# EAGLE design Arduino-WiFi-Shield v1.1 (EAGLE 5.11)
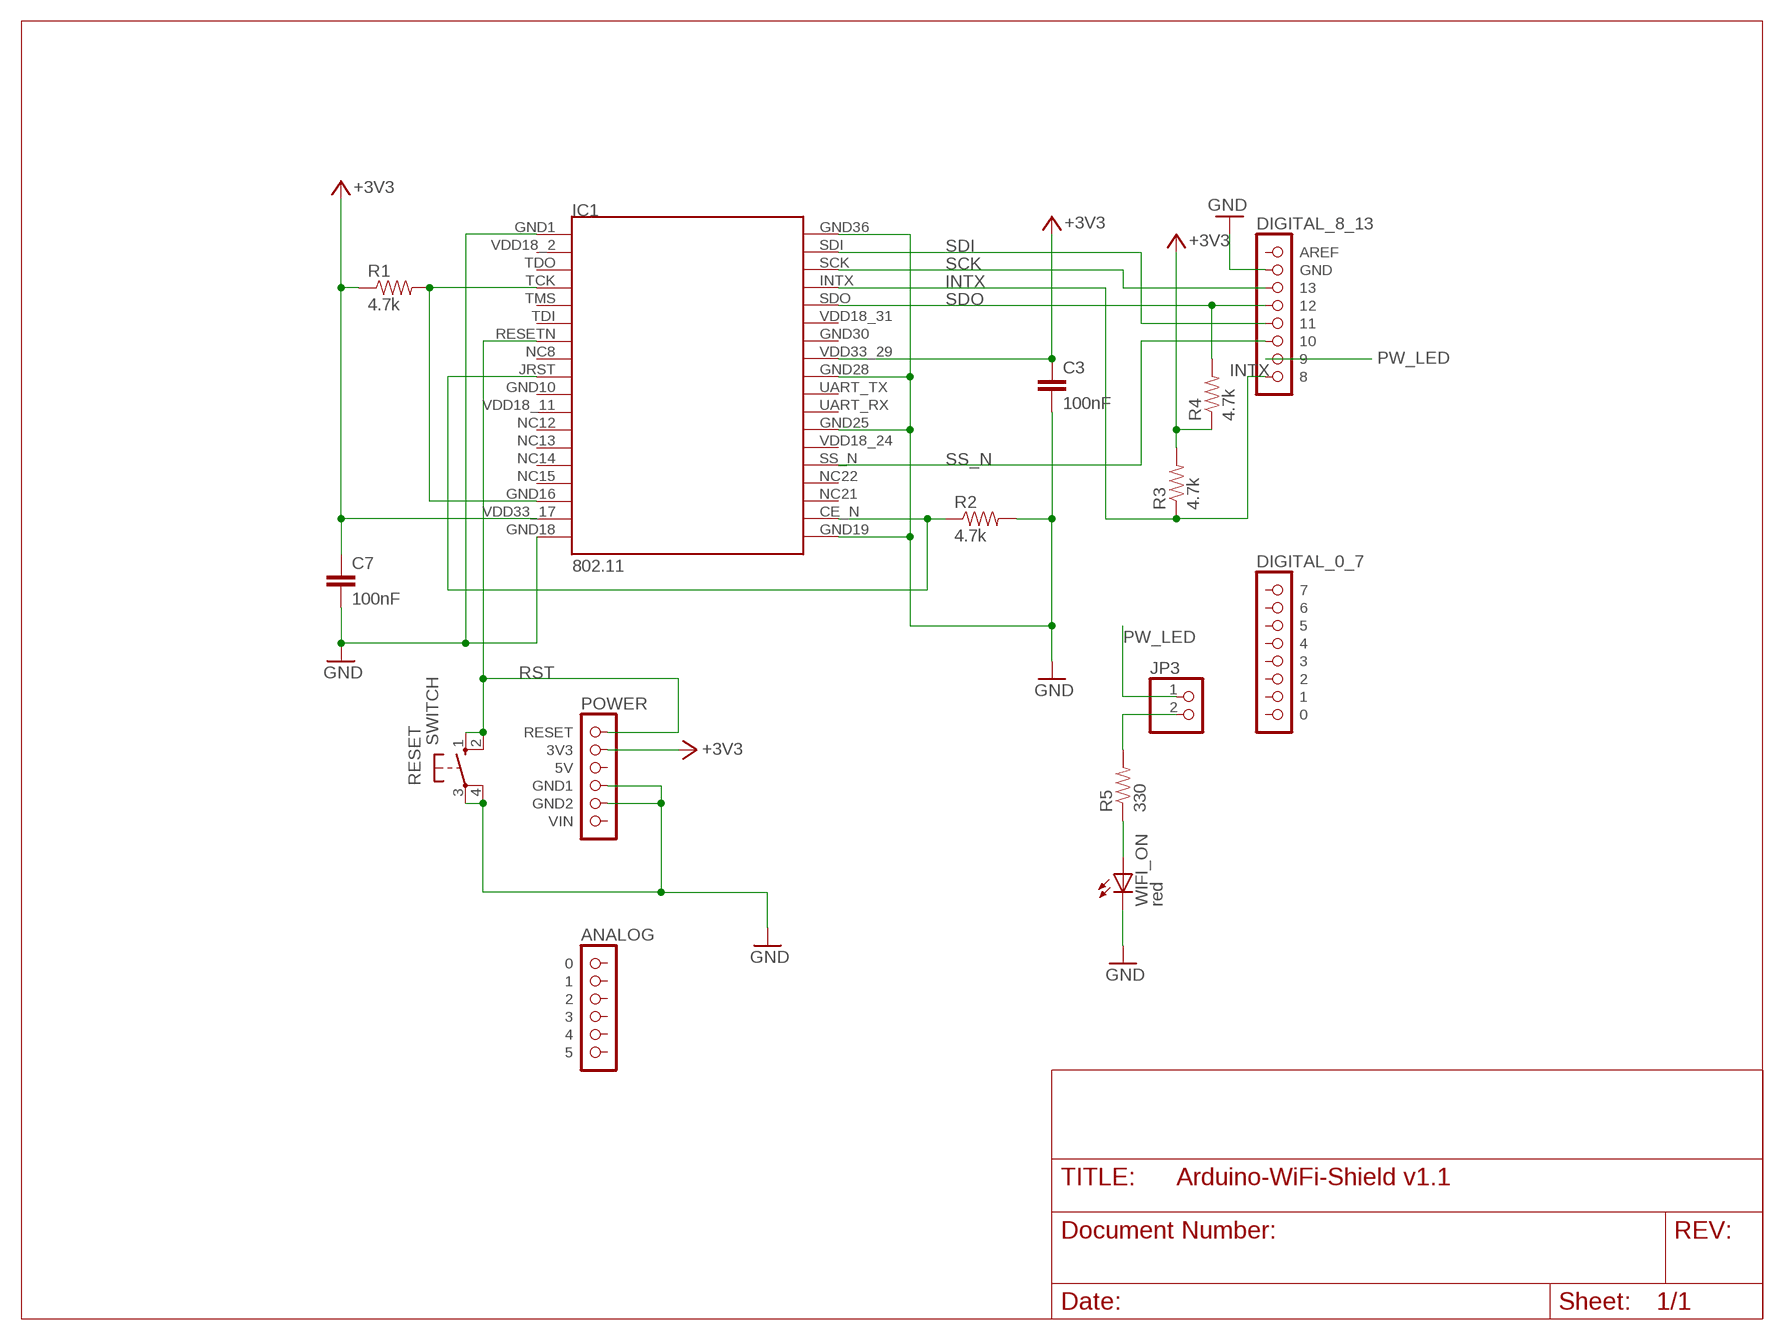
[diagram p0: schematic, sheet 1]

## Parts
C3  100nF  CAPACITOR0603-CAP  [0603-CAP]
C7  100nF  CAPACITOR0603-CAP  [0603-CAP]
IC1  802.11  ZG2100MOD  [ZG2100MOD]
JP3  PINHD2  [PINHD2]
R1  4.7k  RESISTOR0603-RES  [0603-RES]
R2  4.7k  RESISTOR0603-RES  [0603-RES]
R3  4.7k  RESISTOR0603-RES  [0603-RES]
R4  4.7k  RESISTOR0603-RES  [0603-RES]
R5  330  RESISTOR0603-RES  [0603-RES]
RESET  SWITCH  [SWITCH]
U$1  POWER  [1X06]
U$2  ANALOG  [1X06]
U$3  DIGITAL_0_7  [1X08]
U$4  DIGITAL_8_13  [1X08]
WIFI_ON  red  LED0603  [LED-0603]

## Nets
+3V3: C3.1 C7.1 IC1.VDD33_17 IC1.VDD33_29 R1.1 R3.2 R4.1 U$1.2(3V3)
CE_N: IC1.CE_N IC1.JRST R2.1
GND: C3.2 C7.2 IC1.GND1 IC1.GND18 IC1.GND19 IC1.GND25 IC1.GND28 IC1.GND36 R2.2 RESET.3(P) RESET.4(P1) U$1.4(GND1) U$1.5(GND2) U$4.2(GND) WIFI_ON.C
INTX: IC1.INTX R3.1 U$4.8
N$1: JP3.2 R5.2
N$2: R5.1 WIFI_ON.A
PW_LED: JP3.1 U$4.7
RST: IC1.RESETN(RSTN) RESET.1(S) RESET.2(S1) U$1.1(RESET)
SCK: IC1.SCK U$4.3
SDI: IC1.SDI U$4.5
SDO: IC1.SDO R4.2 U$4.4
SS_N: IC1.SS_N U$4.6
VDD_TIE: IC1.GND16 IC1.TCK R1.2
Unconnected: IC1.NC8 IC1.NC12 IC1.NC13 IC1.NC14 IC1.NC15 IC1.NC21 IC1.NC22 IC1.TDI IC1.TDO IC1.TMS IC1.UART_RX IC1.UART_TX IC1.VDD18_2 IC1.VDD18_11 IC1.VDD18_24 IC1.VDD18_31 U$1.3(5V) U$1.6(VIN) U$2.1 U$2.2 U$2.3 U$2.4 U$2.5 U$2.6 U$3.1 U$3.2 U$3.3 U$3.4 U$3.5 U$3.6 U$3.7 U$3.8 U$4.1(AREF)

## Power pins joined to a net without a drawn wire
GND10: IC1.GND10
GND30: IC1.GND30

## Library data of the parts
C3 C7 = asynlabs:CAPACITOR: Capacitor Standard 0603 ceramic capacitor, and 0.1" leaded capacitor.
IC1 = ZGLIB:ZG2100MOD: ZG2100 Module
JP3 = ZGLIB:PINHD2
R1-R5 = asynlabs:RESISTOR: Resistor Basic schematic elements and footprints for 0603, 1206, and PTH 1/10th watt (small) resistors.
RESET = asynlabs:SWITCH
U$1 = arduino:POWER
U$2 = arduino:ANALOG
U$3 = arduino:DIGITAL_0_7
U$4 = arduino:DIGITAL_8_13
WIFI_ON = asynlabs:LED: LEDs Standard schematic elements and footprints for 5mm, 3mm, 1206, and 0603 sized LEDs. 5mm - Spark Fun Electronics SKU : COM-00529 (and others)

## Board
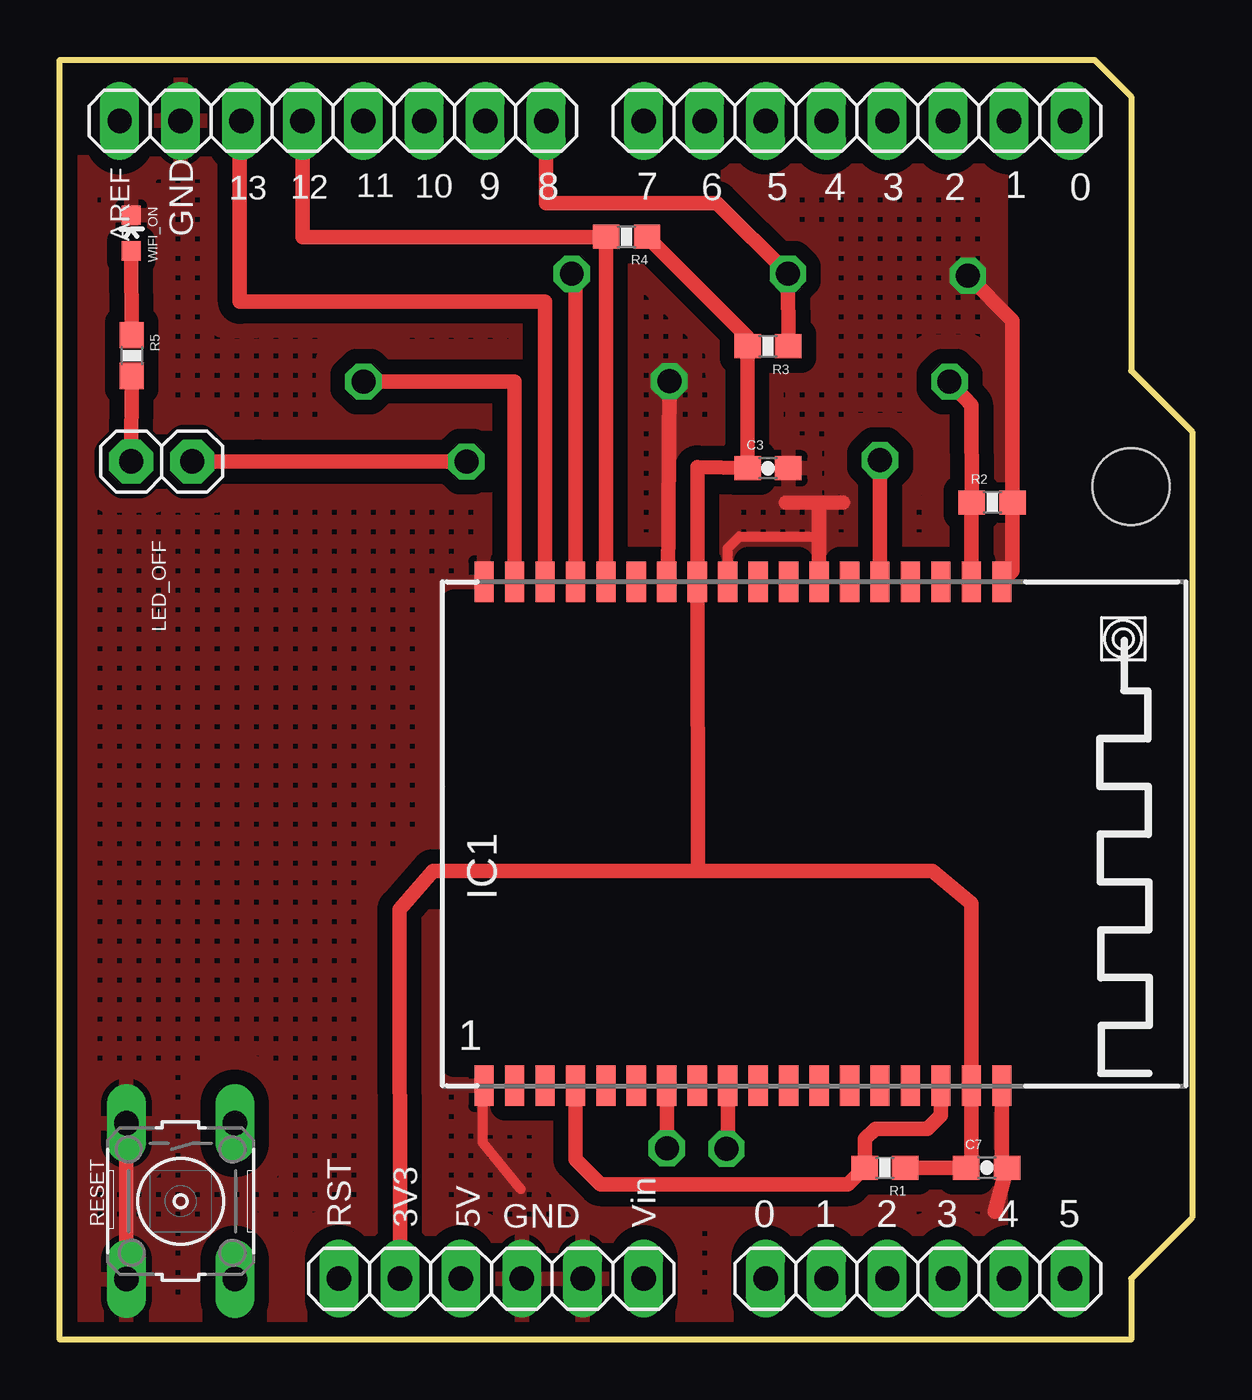
[diagram p1: board, top side]
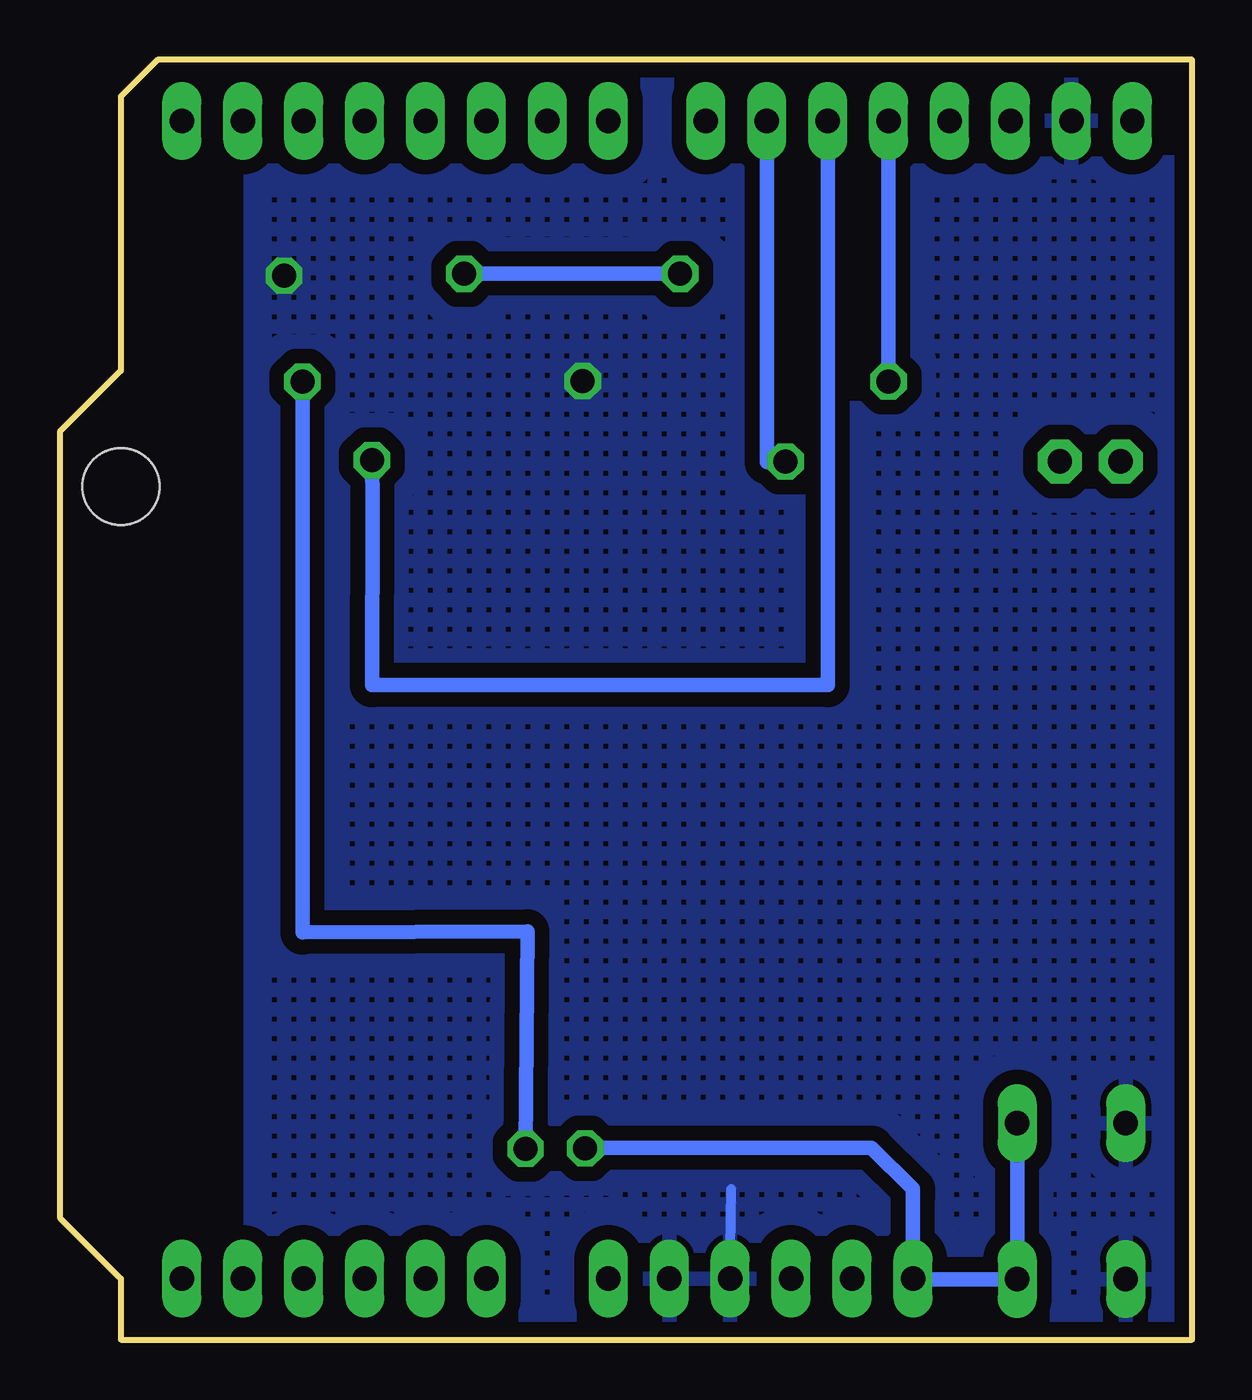
[diagram p2: board, bottom side, seen from below]

Size 47.19 x 53.34 mm. Coordinates in mm from the lower left corner, seen from the top.
Outline: 0,53.34 43.13,53.34 44.65,51.82 44.65,40.39 47.19,37.85 47.19,5.08 44.65,2.54 44.65,0 0,0 0,53.34
Copper layers (1*16): Top 0.035mm / dielectric 1.5mm / Bottom 0.035mm
Design rules "SparkFun *": minimum track width 8mil, minimum drill 16mil, track to track 8mil, track to pad 8mil, pad to pad 8mil, via to via 8mil, smd to smd 8mil, copper to edge 10mil, drill to drill 8mil, minimum pad ring 12mil, minimum via ring 10mil, stop-mask expansion 4mil, vias tented up to drill 25mil, thermal gap 10mil
Holes 3.2 mm at 44.65,35.56
tKeepout: area 39.9,30.7 to 46.8,31.7; area 39.8,10.4 to 46.8,11.5
tRestrict: area 16.5,11.6 to 47.2,30.7

### Footprints (pad centres in the part's own frame; a part is rotated, then mirrored left to right if it is on the bottom)
0603-CAP = smd 1.1 x 1: 1 -0.85,0; 2 0.85,0
ZG2100MOD = smd 0.8 x 1.7: CE_N 6.63,10.12; GND1 -13.69,-10.88; GND10 -2.26,-10.88; GND16 5.36,-10.88; GND18 7.9,-10.88; GND19 7.9,10.12; GND25 0.28,10.12; GND28 -3.53,10.12; GND30 -6.07,10.12; GND36 -13.69,10.12; INTX -9.88,10.12; JRST -3.53,-10.88; NC8 -4.8,-10.88; NC12 0.28,-10.88; NC13 1.55,-10.88; NC14 2.82,-10.88; NC15 4.09,-10.88; NC21 5.36,10.12; NC22 4.09,10.12; RESETN -6.07,-10.88; SCK -11.15,10.12; SDI -12.42,10.12; SDO -8.61,10.12; SS_N 2.82,10.12; TCK -9.88,-10.88; TDI -7.34,-10.88; TDO -11.15,-10.88; TMS -8.61,-10.88; UART_RX -0.99,10.12; UART_TX -2.26,10.12; VDD18_2 -12.42,-10.88; VDD18_11 -0.99,-10.88; VDD18_24 1.55,10.12; VDD18_31 -7.34,10.12; VDD33_17 6.63,-10.88; VDD33_29 -4.8,10.12
PINHD2 = drill 1.016 pad 1.829 octagon: 1 -1.27,0; 2 1.27,0
0603-RES = smd 1.1 x 1: 1 -0.85,0; 2 0.85,0
SWITCH = drill 1.016 long: 1 -3.251,2.261; 2 3.251,2.261; 3 -3.251,-2.261; 4 3.251,-2.261
1X06 = drill 1.016 long: 1 -6.35,0; 2 -3.81,0; 3 -1.27,0; 4 1.27,0; 5 3.81,0; 6 6.35,0
1X08 = drill 1.016 long: 1 -8.89,0; 2 -6.35,0; 3 -3.81,0; 4 -1.27,0; 5 1.27,0; 6 3.81,0; 7 6.35,0; 8 8.89,0
LED-0603 = smd 0.8 x 0.8: A 0,-0.75; C 0,0.75

### Placement (x,y rotation side)
C3  29.51,36.32 0 top
C7  38.63,7.16 0 top
IC1  31.37,21.46 0 top
JP3  4.24,36.6 180 top
R1  34.39,7.16 180 top
R2  38.86,34.9 0 top
R3  29.51,41.4 180 top
R4  23.62,45.97 180 top
R5  3,41.02 270 top
RESET  5.03,5.77 270 top
U$1  17.98,2.54 0 top
U$2  35.76,2.54 0 top
U$3  33.22,50.8 0 top
U$4  11.38,50.8 0 top
WIFI_ON  2.97,46.13 0 top

### Tracks (layer width: path | path; a pad name or v marks a point on that pad's centre or on a via)
+3V3
  Top 0.61: IC1.VDD33_29 26.59,31.56 | 26.59,19.53 27.61,19.53 36.37,19.53 38,18.19 IC1.VDD33_17 38,7.5 C7.1 R1.1 | 26.59,19.53 IC1.VDD33_29 | U$1.2 14.15,17.93 15.55,19.53 26.59,19.53 | IC1.VDD33_29 26.57,36.36 C3.1 R3.2 28.67,41.78 R4.1
CE_N  (via drill 1)
  Top 0.61: IC1.JRST 27.84,8.23 v27.79,7.95 | IC1.CE_N 38,34.89 R2.1 37.99,38.95 v37.08,39.93
  Bottom 0.61: v27.79,7.95 27.71,17.02 37.08,16.97 v37.08,39.93
GND  (via drill 1)
  Top 0.406: IC1.GND28 27.84,32.99 28.32,33.48 31.44,33.48 31.65,33.17 | 19.2,6.27 17.63,8.2 17.63,10.53 IC1.GND1
  Top 0.61: IC1.GND1 | RESET.4 RESET.3 | 31.65,34.9 31.65,33.17 IC1.GND25 | 31.65,34.9 | 31.65,34.9 31.52,34.9 | 31.52,34.9 30.26,34.9 | 32.64,34.9 31.52,34.9 | 25.35,31.53 v25.4,39.95 | IC1.GND18 39.27,7.3 C7.2 38.96,5.33 | IC1.GND19 39.71,32.03 R2.2 39.71,42.48 v37.85,44.35
  Bottom 0.406: U$1.4 19.2,6.27
  pour Bottom (isolate 0.61, hatched): 0.08,53.39 39.24,53.39 39.24,0.1 0.08,0.1 0.08,2.26 0,2.26 0,53.47
  pour Top (isolate 0.61, hatched): 0.05,53.37 39.22,53.37 39.22,0.08 0.05,0.08 0.05,2.24 -0.03,2.24 -0.03,53.44
INTX  (via drill 1)
  Top 0.305: IC1.INTX
  Top 0.61: R3.1 v30.35,44.42 27.38,47.37 20.27,47.37 20.27,50.77 U$4.8 | IC1.INTX 21.49,44.22 v21.34,44.42
  Bottom 0.61: v21.34,44.42 v30.35,44.42
N$1
  Top 0.61: JP3.2 R5.2
N$2
  Top 0.61: R5.1 WIFI_ON.A
PW_LED  (via drill 1)
  Top 0.61: v16.94,36.6 8.26,36.6 JP3.1
  Bottom 0.61: v16.94,36.6 17.73,36.58 U$4.7
RST  (via drill 1)
  Top 0.305: IC1.RESETN
  Top 0.61: v25.3,7.98 IC1.RESETN
  Bottom 0.61: RESET.1 RESET.2 11.61,2.51 U$1.1 11.63,5.94 11.63,6.27 13.36,8 25.27,8 v25.3,7.98
SCK
  Top 0.305: IC1.SCK
  Top 0.61: IC1.SCK 20.22,43.23 20.22,43.26 7.49,43.26 7.49,50.8 U$4.3
SDI  (via drill 1)
  Top 0.61: IC1.SDI 18.95,39.93 v12.65,39.93
  Bottom 0.61: v12.65,39.93 U$4.5
SDO
  Top 0.305: IC1.SDO
  Top 0.61: IC1.SDO 22.76,45.95 | 22.76,45.95 22.76,45.97 | 22.76,45.97 R4.2 | 22.76,45.95 22.76,45.97 | 22.76,45.95 10.11,45.95 U$4.4
SS_N  (via drill 1)
  Top 0.61: v34.19,36.65 IC1.SS_N
  Bottom 0.61: U$4.6 15.19,27.28 34.19,27.28 34.16,34.8 v34.19,36.65
VDD_TIE
  Top 0.305: IC1.GND16
  Top 0.61: IC1.TCK 21.49,7.52 22.53,6.48 32.86,6.48 R1.2 33.55,7.17 33.55,8.36 33.99,8.79 36.17,8.79 36.73,9.35 IC1.GND16

### Text on the board
tNames: 13 | 12 | 11 | 10 | 9 | 8 | 6 | 5 | 4 | 3 | 2 | 1 | 0 | 7 | AREF | GND | LED_OFF | GND | RST | 3V3 | 5V | Vin | 0 | 1 | 2 | 3 | 4 | 5